# Altium schematic sheet ARM_EURO_Platine7.SchDoc
size A4; PageSetup: Record=PageOptions|CenterHorizontal=True|CenterVertical=True|PrintScale=1.00|XCorrection=1.00|YCorrection=1.00|PrintKind=0|BorderSize=5000000|LeftOffset=0|BottomOffset=0|Orientation=2|PaperLength=1000|PaperWidth=1000|Scale=100|PaperSource=7|PrintQuality=-3|MediaType=1|DitherType=10|PrintScaleMode=1|PaperKind=A4|PaperIndex=9
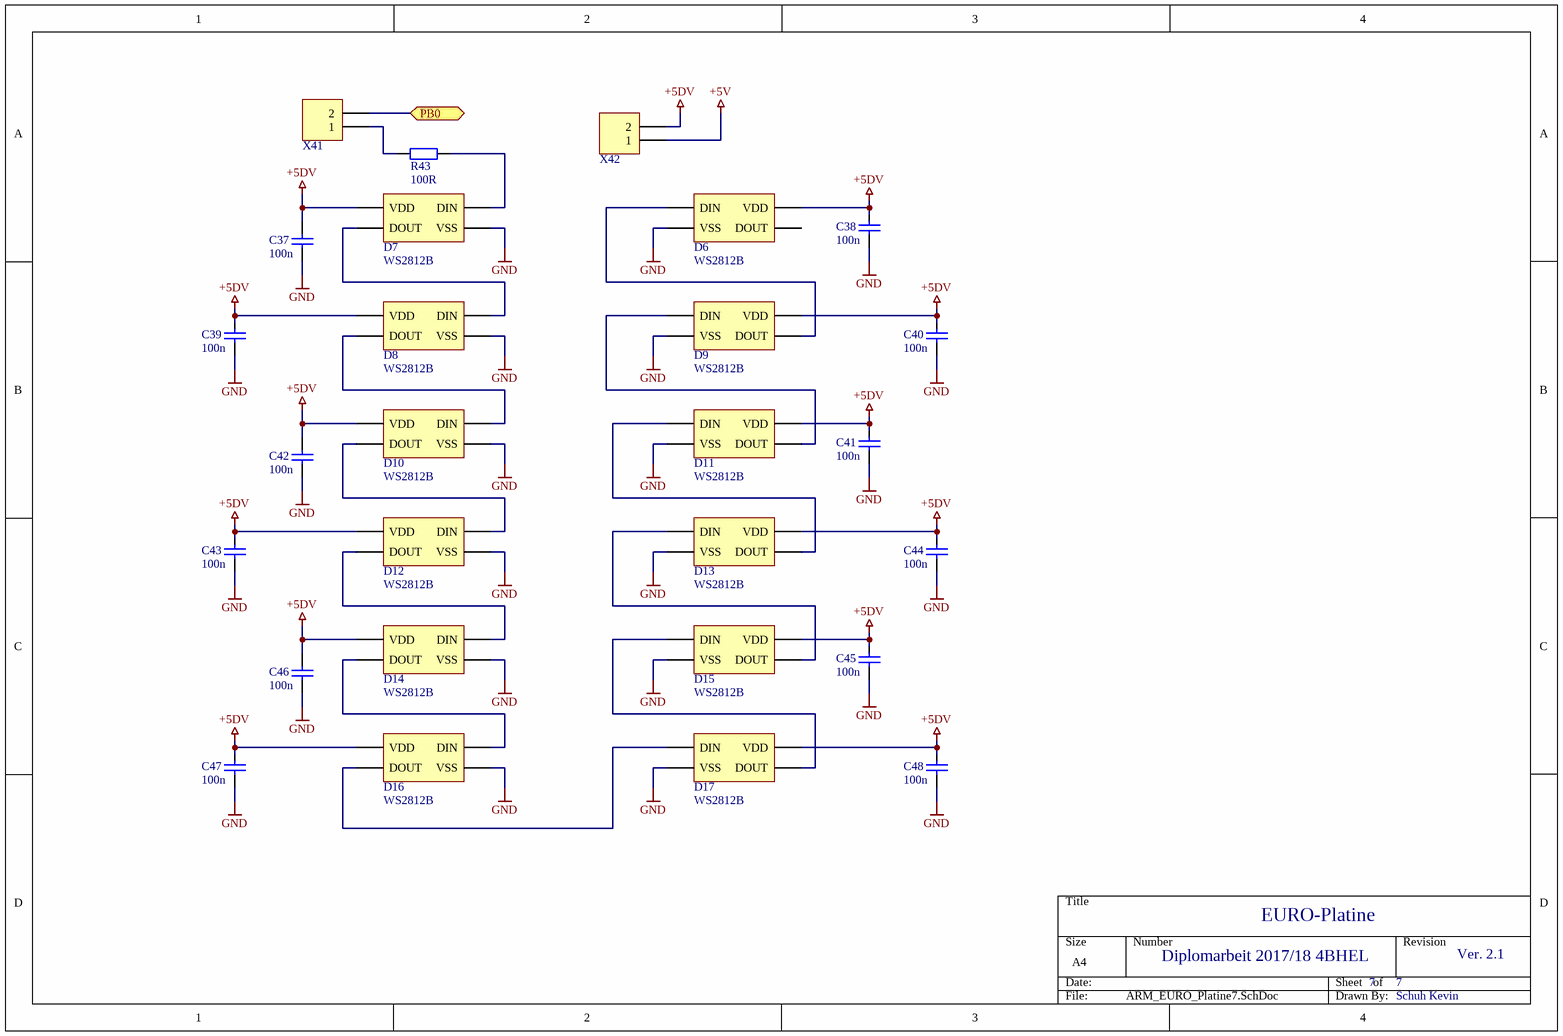
[diagram p0: ARM_EURO_Platine7.SchDoc]

## Parts
C37  value 100n  [0805_CAP]  (hidden comment: Cap_Keramik_SMD)
C38  value 100n  [0805_CAP]  (hidden comment: Cap_Keramik_SMD)
C39  value 100n  [0805_CAP]  (hidden comment: Cap_Keramik_SMD)
C40  value 100n  [0805_CAP]  (hidden comment: Cap_Keramik_SMD)
C41  value 100n  [0805_CAP]  (hidden comment: Cap_Keramik_SMD)
C42  value 100n  [0805_CAP]  (hidden comment: Cap_Keramik_SMD)
C43  value 100n  [0805_CAP]  (hidden comment: Cap_Keramik_SMD)
C44  value 100n  [0805_CAP]  (hidden comment: Cap_Keramik_SMD)
C45  value 100n  [0805_CAP]  (hidden comment: Cap_Keramik_SMD)
C46  value 100n  [0805_CAP]  (hidden comment: Cap_Keramik_SMD)
C47  value 100n  [0805_CAP]  (hidden comment: Cap_Keramik_SMD)
C48  value 100n  [0805_CAP]  (hidden comment: Cap_Keramik_SMD)
D6  WS2812B  [WS2812B]
D7  WS2812B  [WS2812B]
D8  WS2812B  [WS2812B]
D9  WS2812B  [WS2812B]
D10  WS2812B  [WS2812B]
D11  WS2812B  [WS2812B]
D12  WS2812B  [WS2812B]
D13  WS2812B  [WS2812B]
D14  WS2812B  [WS2812B]
D15  WS2812B  [WS2812B]
D16  WS2812B  [WS2812B]
D17  WS2812B  [WS2812B]
R43  value 100R  [0805_Res]  (hidden comment: Res_SMD)
X41  Header  [HDR1X2]  (value not drawn)
X42  Header  [HDR1X2]  (value not drawn)

## Ports
PB0

## Nets
+5DV: C37.2 C38.2 C39.2 C40.2 C41.2 C42.2 C43.2 C44.2 C45.2 C46.2 C47.2 C48.2 D6.1(VDD) D7.1(VDD) D8.1(VDD) D9.1(VDD) D10.1(VDD) D11.1(VDD) D12.1(VDD) D13.1(VDD) D14.1(VDD) D15.1(VDD) D16.1(VDD) D17.1(VDD) X42.2
+5V: X42.1
GND: C37.1 C38.1 C39.1 C40.1 C41.1 C42.1 C43.1 C44.1 C45.1 C46.1 C47.1 C48.1 D6.3(VSS) D7.3(VSS) D8.3(VSS) D9.3(VSS) D10.3(VSS) D11.3(VSS) D12.3(VSS) D13.3(VSS) D14.3(VSS) D15.3(VSS) D16.3(VSS) D17.3(VSS)
PB0: X41.2 ; port PB0
NetD6_4: D6.4(DIN) D9.2(DOUT)
NetD7_2: D7.2(DOUT) D8.4(DIN)
NetD7_4: D7.4(DIN) R43.2
NetD8_2: D8.2(DOUT) D10.4(DIN)
NetD9_4: D9.4(DIN) D11.2(DOUT)
NetD10_2: D10.2(DOUT) D12.4(DIN)
NetD11_4: D11.4(DIN) D13.2(DOUT)
NetD12_2: D12.2(DOUT) D14.4(DIN)
NetD13_4: D13.4(DIN) D15.2(DOUT)
NetD14_2: D14.2(DOUT) D16.4(DIN)
NetD15_4: D15.4(DIN) D17.2(DOUT)
NetD16_2: D16.2(DOUT) D17.4(DIN)
NetR43_1: R43.1 X41.1

Not connected (* = marked no-connect by the designer): D6 2(DOUT)

## Notes on the sheet
- EURO-Platine
- Diplomarbeit 2017/18 4BHEL
- 7
- Ver. 2.1
- Schuh Kevin

## Library data of the parts
C37-C48 = Cap_Keramik_SMD: Capacitor_SMD; Published: 8-Jun-2000; LatestRevisionDate: 17-Jul-2002; LatestRevisionNote: Re-released for DXP Platform.; PackageReference: RAD-0.3; Publisher: Altium Limited
R43 = Res_SMD: Resistor; Published: 8-Jun-2000; LatestRevisionDate: 17-Jul-2002; LatestRevisionNote: Re-released for DXP Platform.; PackageReference: AXIAL-0.4; Publisher: Altium Limited
X41 X42 = Header_2: Header, 2-Pin; LatestRevisionDate: 17-Jul-2002; LatestRevisionNote: Re-released for DXP Platform.; Publisher: Altium Limited
D6-D17 = WS2812B: LatestRevisionDate: 17-Jul-2002; LatestRevisionNote: Re-released for DXP Platform.; Publisher: Altium Limited